# EAGLE design zxmem (EAGLE 4.08)
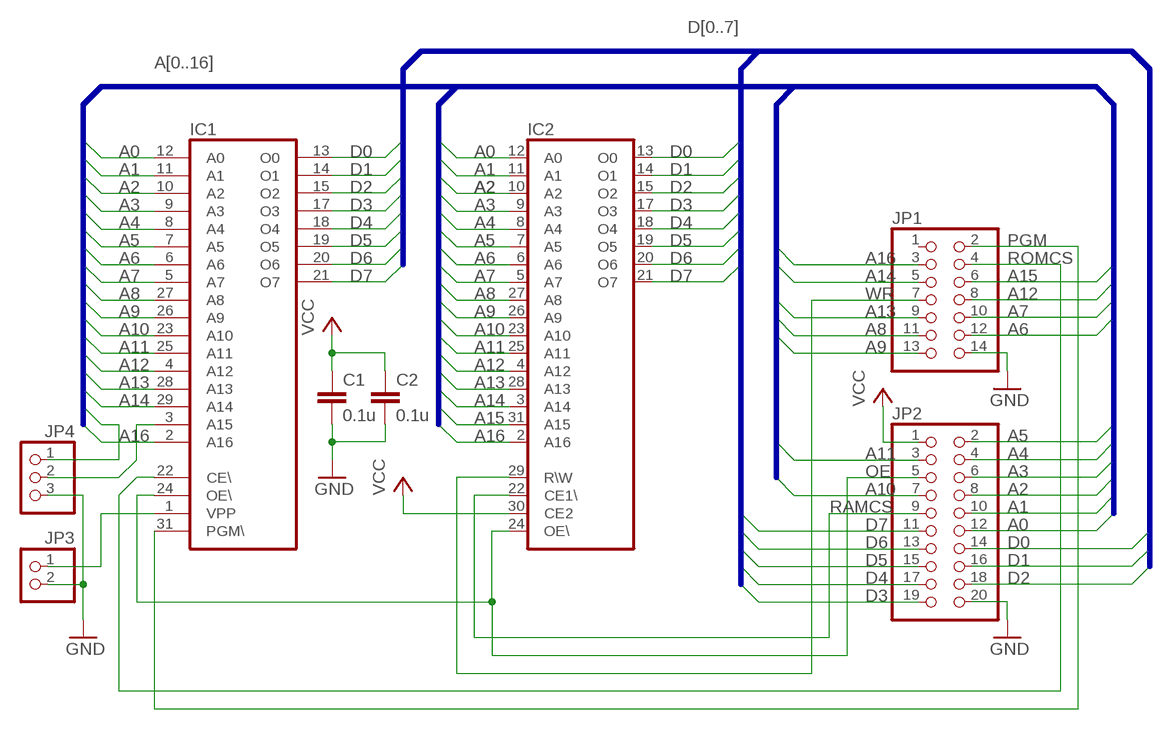
[diagram p0: schematic, sheet 1]

## Parts
C1  0.1u  C-EU050-025X075  [C050-025X075]
C2  0.1u  C-EU050-025X075  [C050-025X075]
IC1  27010  [DIL32]
IC2  TC551001CP  [DIL32]
JP1  PINHD-2X7  [2X07]
JP2  PINHD-2X10  [2X10]
JP3  PINHD-1X2  [1X02]
JP4  PINHD-1X3  [1X03]

## Nets
A0: IC1.12(A0) IC2.12(A0) JP2.12
A1: IC1.11(A1) IC2.11(A1) JP2.10
A2: IC1.10(A2) IC2.10(A2) JP2.8
A3: IC1.9(A3) IC2.9(A3) JP2.6
A4: IC1.8(A4) IC2.8(A4) JP2.4
A5: IC1.7(A5) IC2.7(A5) JP2.2
A6: IC1.6(A6) IC2.6(A6) JP1.12
A7: IC1.5(A7) IC2.5(A7) JP1.10
A8: IC1.27(A8) IC2.27(A8) JP1.11
A9: IC1.26(A9) IC2.26(A9) JP1.13
A10: IC1.23(A10) IC2.23(A10) JP2.7
A11: IC1.25(A11) IC2.25(A11) JP2.3
A12: IC1.4(A12) IC2.4(A12) JP1.8
A13: IC1.28(A13) IC2.28(A13) JP1.9
A14: IC1.29(A14) IC2.3(A14) JP1.5
A15: IC2.31(A15) JP1.6 JP4.1
A16: IC1.2(A16) IC2.2(A16) JP1.3
D0: IC1.13(O0) IC2.13(O0) JP2.14
D1: IC1.14(O1) IC2.14(O1) JP2.16
D2: IC1.15(O2) IC2.15(O2) JP2.18
D3: IC1.17(O3) IC2.17(O3) JP2.19
D4: IC1.18(O4) IC2.18(O4) JP2.17
D5: IC1.19(O5) IC2.19(O5) JP2.15
D6: IC1.20(O6) IC2.20(O6) JP2.13
D7: IC1.21(O7) IC2.21(O7) JP2.11
GND: C1.2 C2.2 JP1.14 JP2.20 JP3.2 JP4.3
N$1: IC1.3(A15) JP4.2
N$6: IC1.1(VPP) JP3.1
OE: IC1.24(OE\) IC2.24(OE\) JP2.5
PGM: IC1.31(PGM\) JP1.2
RAMCS: IC2.22(CE1\) JP2.9
ROMCS: IC1.22(CE\) JP1.4
VCC: C1.1 C2.1 IC2.30(CE2) JP2.1
WR: IC2.29(R\W) JP1.7
Unconnected: IC2.1(NC) JP1.1

## Buses
A[0..16]
D[0..7]

## Power pins joined to a net without a drawn wire
GND: IC1.16(GND) IC2.16(GND)
VCC: IC1.32(VCC) IC2.32(VCC)

## Library data of the parts
C1 C2 = rcl:C-EU: CAPACITOR, European symbol
IC1 = memory:27010: MEMORY
IC2 = memory:TC551001CP: MEMORY
JP1 = pinhead:PINHD-2X7: PIN HEADER
JP2 = pinhead:PINHD-2X10: PIN HEADER
JP3 = pinhead:PINHD-1X2: PIN HEADER
JP4 = pinhead:PINHD-1X3: PIN HEADER

## Board
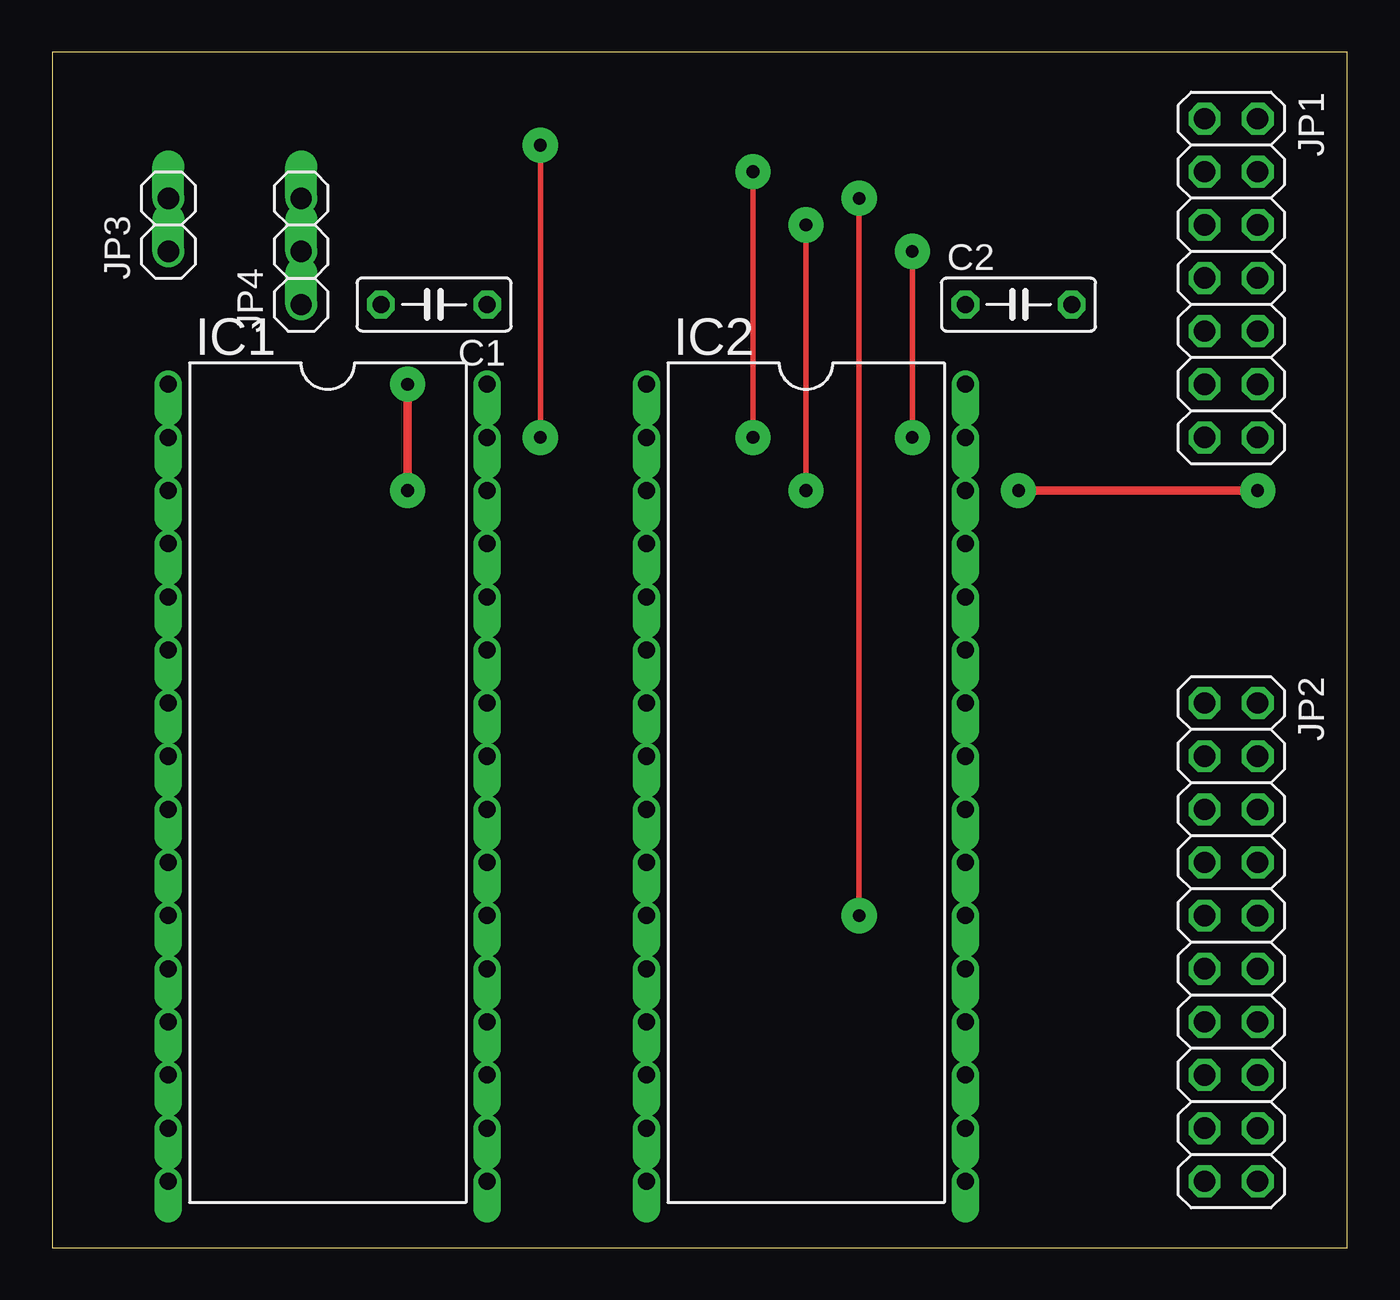
[diagram p1: board, top side]
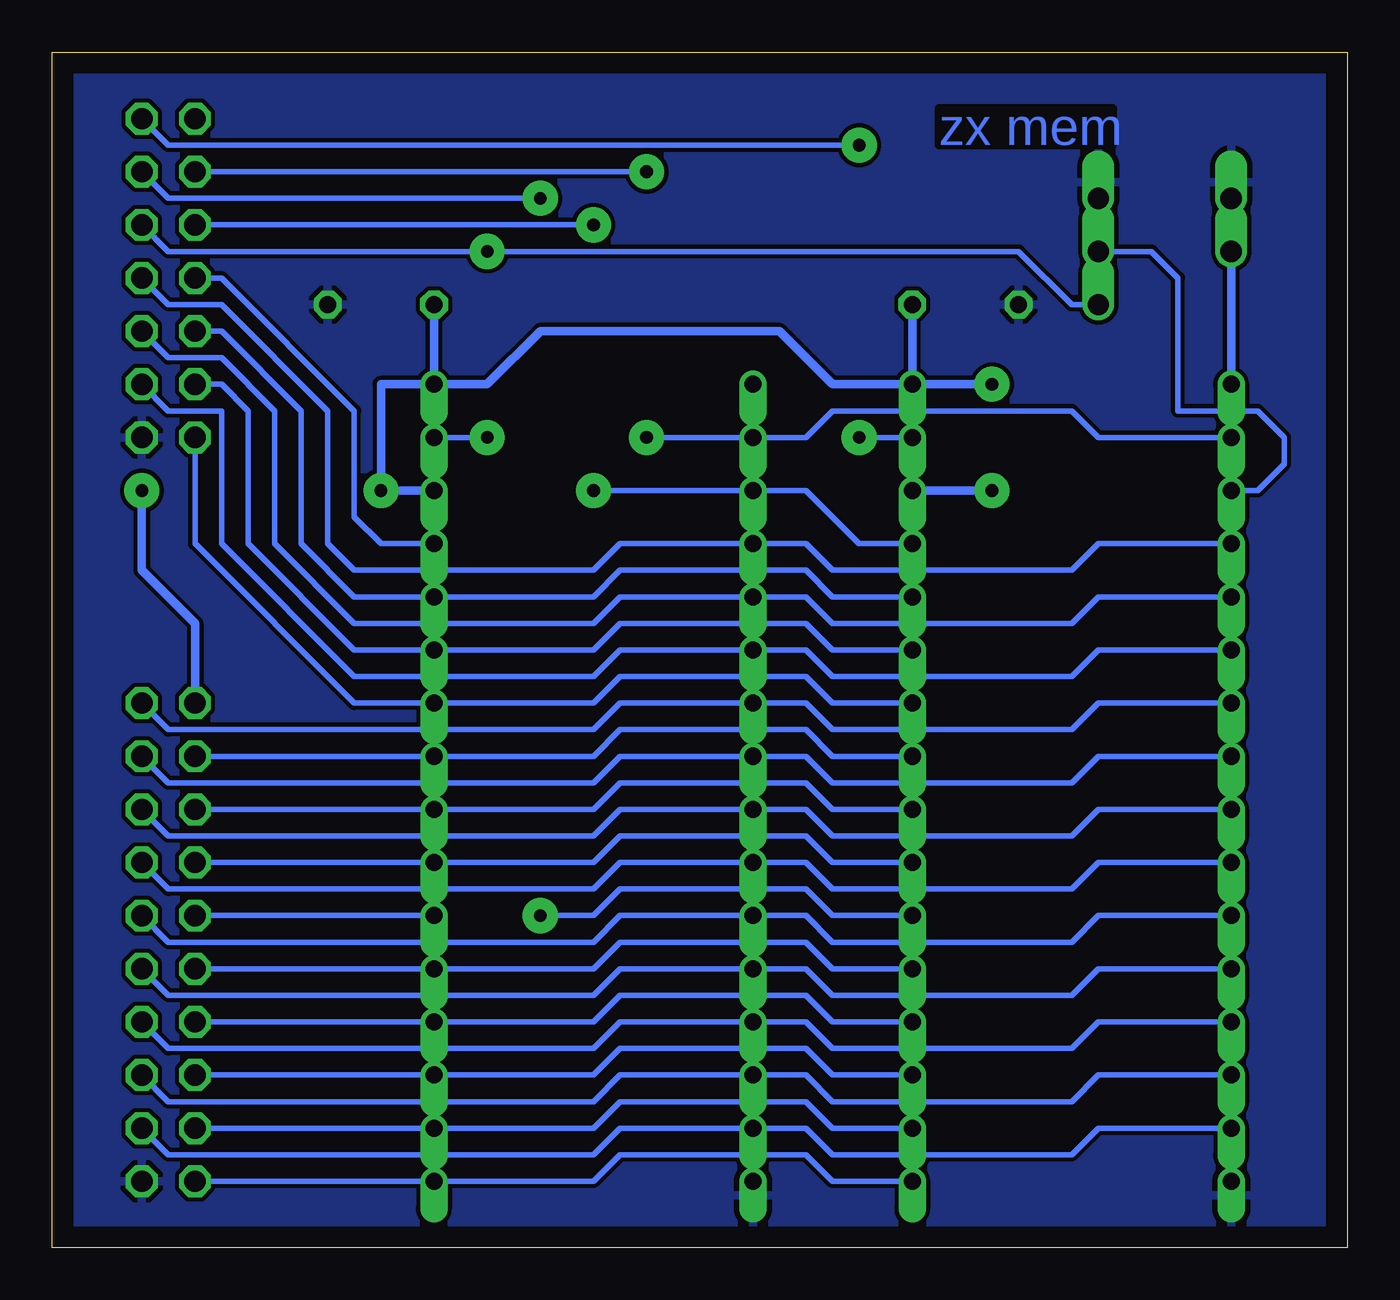
[diagram p2: board, bottom side, seen from below]

Size 61.9 x 57.14 mm. Coordinates in mm from the lower left corner, seen from the top.
Outline: 0,0 61.9,0 61.9,57.14 0,57.14 0,0
Copper layers used: Top, Bottom

### Footprints (pad centres in the part's own frame; a part is rotated, then mirrored left to right if it is on the bottom)
C050-025X075 = drill 0.813 octagon: 1 -2.54,0; 2 2.54,0
DIL32 = drill 0.813 offset: 1 -19.05,-7.62; 2 -16.51,-7.62; 3 -13.97,-7.62; 4 -11.43,-7.62; 5 -8.89,-7.62; 6 -6.35,-7.62; 7 -3.81,-7.62; 8 -1.27,-7.62; 9 1.27,-7.62; 10 3.81,-7.62; 11 6.35,-7.62; 12 8.89,-7.62; 13 11.43,-7.62; 14 13.97,-7.62; 15 16.51,-7.62; 16 19.05,-7.62; 17 19.05,7.62; 18 16.51,7.62; 19 13.97,7.62; 20 11.43,7.62; 21 8.89,7.62; 22 6.35,7.62; 23 3.81,7.62; 24 1.27,7.62; 25 -1.27,7.62; 26 -3.81,7.62; 27 -6.35,7.62; 28 -8.89,7.62; 29 -11.43,7.62; 30 -13.97,7.62; 31 -16.51,7.62; 32 -19.05,7.62
2X07 = drill 1.016 octagon: 1 -7.62,-1.27; 2 -7.62,1.27; 3 -5.08,-1.27; 4 -5.08,1.27; 5 -2.54,-1.27; 6 -2.54,1.27; 7 0,-1.27; 8 0,1.27; 9 2.54,-1.27; 10 2.54,1.27; 11 5.08,-1.27; 12 5.08,1.27; 13 7.62,-1.27; 14 7.62,1.27
2X10 = drill 1.016 octagon: 1 -11.43,-1.27; 2 -11.43,1.27; 3 -8.89,-1.27; 4 -8.89,1.27; 5 -6.35,-1.27; 6 -6.35,1.27; 7 -3.81,-1.27; 8 -3.81,1.27; 9 -1.27,-1.27; 10 -1.27,1.27; 11 1.27,-1.27; 12 1.27,1.27; 13 3.81,-1.27; 14 3.81,1.27; 15 6.35,-1.27; 16 6.35,1.27; 17 8.89,-1.27; 18 8.89,1.27; 19 11.43,-1.27; 20 11.43,1.27
1X02 = drill 1.016 offset: 1 -1.27,0; 2 1.27,0
1X03 = drill 1.016 offset: 1 -2.54,0; 2 0,0; 3 2.54,0

### Placement (x,y rotation side)
C1  18.25,45.08 180 top
C2  46.19,45.08 0 top
IC1  13.17,22.22 270 top
IC2  36.03,22.22 270 top
JP1  56.35,46.35 270 top
JP2  56.35,14.6 270 top
JP3  5.55,48.89 90 top
JP4  11.9,47.62 90 top

### Tracks (layer width: path | path; a pad name or v marks a point on that pad's centre or on a via)
A0
  Bottom 0.254: IC1.12 11.9,13.33 13.17,12.06 24.6,12.06 25.87,13.33 IC2.12 34.76,13.33 36.03,12.06 56.35,12.06 JP2.12
A1
  Bottom 0.254: IC1.11 11.9,15.87 13.17,14.6 24.6,14.6 25.87,15.87 IC2.11 34.76,15.87 36.03,14.6 56.35,14.6 JP2.10
A2
  Bottom 0.254: IC1.10 11.9,18.41 13.17,17.14 24.6,17.14 25.87,18.41 IC2.10 34.76,18.41 36.03,17.14 56.35,17.14 JP2.8
A3
  Bottom 0.254: IC1.9 11.9,20.95 13.17,19.68 24.6,19.68 25.87,20.95 IC2.9 34.76,20.95 36.03,19.68 56.35,19.68 JP2.6
A4
  Bottom 0.254: IC1.8 11.9,23.49 13.17,22.22 24.6,22.22 25.87,23.49 IC2.8 34.76,23.49 36.03,22.22 56.35,22.22 JP2.4
A5
  Bottom 0.254: IC1.7 11.9,26.03 13.17,24.76 24.6,24.76 25.87,26.03 IC2.7 34.76,26.03 36.03,24.76 56.35,24.76 JP2.2
A6
  Bottom 0.254: IC1.6 11.9,28.57 13.17,27.3 24.6,27.3 25.87,28.57 IC2.6 34.76,28.57 36.03,27.3 47.46,27.3 53.81,33.65 53.81,40 56.35,40 JP1.12
A7
  Bottom 0.254: IC1.5 11.9,31.11 13.17,29.84 24.6,29.84 25.87,31.11 IC2.5 34.76,31.11 36.03,29.84 47.46,29.84 51.27,33.65 51.27,40 53.81,42.54 56.35,42.54 JP1.10
A8
  Bottom 0.254: IC1.27 24.6,28.57 25.87,29.84 34.76,29.84 36.03,28.57 IC2.27 47.46,28.57 52.54,33.65 52.54,40 53.81,41.27 JP1.11
A9
  Bottom 0.254: IC1.26 24.6,26.03 25.87,27.3 34.76,27.3 36.03,26.03 IC2.26 47.46,26.03 55.08,33.65 JP1.13
A10
  Bottom 0.254: IC1.23 24.6,18.41 25.87,19.68 34.76,19.68 36.03,18.41 IC2.23 JP2.7
A11
  Bottom 0.254: IC1.25 24.6,23.49 25.87,24.76 34.76,24.76 36.03,23.49 IC2.25 JP2.3
A12
  Bottom 0.254: IC1.4 11.9,33.65 13.17,32.38 24.6,32.38 25.87,33.65 IC2.4 34.76,33.65 36.03,32.38 47.46,32.38 48.73,33.65 48.73,40 53.81,45.08 56.35,45.08 JP1.8
A13
  Bottom 0.254: IC1.28 24.6,31.11 25.87,32.38 34.76,32.38 36.03,31.11 IC2.28 47.46,31.11 50,33.65 50,40 53.81,43.81 JP1.9
A14  (via drill 0.61 pad 1.68)
  Top 0.254: v36.03,36.19 v36.03,48.89
  Bottom 0.254: IC1.29 23.33,33.65 25.87,36.19 IC2.3 v36.03,36.19 | v36.03,48.89 JP1.5
A15  (via drill 0.61 pad 1.68)
  Top 0.254: v41.11,47.62 v41.11,38.73
  Bottom 0.254: v41.11,38.73 IC2.31 | JP1.6 56.35,47.62 v41.11,47.62 15.71,47.62 13.17,45.08 JP4.1
A16  (via drill 0.61 pad 1.68)
  Top 0.254: v33.49,38.73 v33.49,51.43
  Bottom 0.254: IC1.2 11.9,38.73 13.17,40 24.6,40 25.87,38.73 IC2.2 v33.49,38.73 | v33.49,51.43 JP1.3
D0
  Bottom 0.254: IC1.13 11.9,10.79 13.17,9.52 24.6,9.52 25.87,10.79 IC2.13 34.76,10.79 36.03,9.52 56.35,9.52 JP2.14
D1
  Bottom 0.254: IC1.14 11.9,8.25 13.17,6.98 24.6,6.98 25.87,8.25 IC2.14 34.76,8.25 36.03,6.98 56.35,6.98 JP2.16
D2
  Bottom 0.254: IC1.15 11.9,5.71 13.17,4.44 24.6,4.44 25.87,5.71 IC2.15 34.76,5.71 36.03,4.44 56.35,4.44 JP2.18
D3
  Bottom 0.254: IC1.17 24.6,3.17 25.87,4.44 34.76,4.44 36.03,3.17 IC2.17 JP2.19
D4
  Bottom 0.254: IC1.18 24.6,5.71 25.87,6.98 34.76,6.98 36.03,5.71 IC2.18 JP2.17
D5
  Bottom 0.254: IC1.19 24.6,8.25 25.87,9.52 34.76,9.52 36.03,8.25 IC2.19 JP2.15
D6
  Bottom 0.254: IC1.20 24.6,10.79 25.87,12.06 34.76,12.06 36.03,10.79 IC2.20 JP2.13
D7
  Bottom 0.254: IC1.21 24.6,13.33 25.87,14.6 34.76,14.6 36.03,13.33 IC2.21 JP2.11
GND
  pour Bottom: 0.47,56.51 0.47,0.63 61.43,0.63 61.43,56.51
N$1
  Bottom 0.254: IC1.3 4.28,36.19 3.01,37.46 3.01,38.73 4.28,40 8.09,40 8.09,46.35 9.36,47.62 JP4.2
N$6
  Bottom 0.406: IC1.1 JP3.1
OE
  Bottom 0.254: IC1.24 24.6,20.95 25.87,22.22 34.76,22.22 36.03,20.95 IC2.24 JP2.5
PGM  (via drill 0.61 pad 1.68)
  Top 0.254: v23.33,38.73 v23.33,52.7
  Bottom 0.254: JP1.2 56.35,52.7 v23.33,52.7 | IC1.31 v23.33,38.73
RAMCS
  Bottom 0.254: IC2.22 JP2.9
ROMCS  (via drill 0.61 pad 1.68)
  Top 0.254: v38.57,15.87 v38.57,50.16
  Bottom 0.254: IC1.22 24.6,15.87 25.87,17.14 34.76,17.14 36.03,15.87 v38.57,15.87 | v38.57,50.16 56.35,50.16 JP1.4
VCC  (via drill 0.61 pad 1.68)
  Top 0.406: v46.19,36.19 v57.62,36.19 | v16.98,36.19 v16.98,41.27
  Bottom 0.406: JP2.1 55.08,29.84 57.62,32.38 v57.62,36.19 | IC2.30 v46.19,36.19 46.19,41.27 IC2.32 | IC2.32 41.11,41.27 38.57,43.81 27.14,43.81 24.6,41.27 IC1.32 | v16.98,41.27 IC1.32 | v16.98,36.19 20.79,36.19 | IC1.32 C1.1 | IC2.32 C2.1
WR
  Bottom 0.254: IC2.29 46.19,33.65 47.46,34.92 47.46,40 53.81,46.35 JP1.7

### Text on the board
Bottom: zx mem